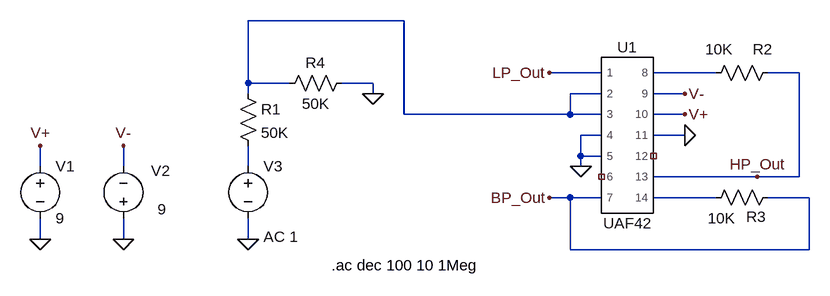
[diagram p0: schematic UAF_Example.asc]
UAF_Example.asc, the LTspice schematic file:
Version 4
SHEET 1 880 680
WIRE -144 16 -384 16
WIRE 160 96 80 96
WIRE 336 96 240 96
WIRE 464 96 416 96
WIRE -384 112 -384 16
WIRE -320 112 -384 112
WIRE -192 112 -240 112
WIRE -384 128 -384 112
WIRE -192 128 -192 112
WIRE 160 128 112 128
WIRE 288 128 240 128
WIRE -144 160 -144 16
WIRE 112 160 112 128
WIRE 112 160 -144 160
WIRE 160 160 112 160
WIRE 288 160 240 160
WIRE 160 192 128 192
WIRE 288 192 240 192
WIRE 128 224 128 192
WIRE 160 224 128 224
WIRE -704 240 -704 208
WIRE -576 240 -576 208
WIRE -384 240 -384 208
WIRE 128 240 128 224
WIRE 400 256 240 256
WIRE 464 256 464 96
WIRE 464 256 400 256
WIRE 112 288 80 288
WIRE 160 288 112 288
WIRE 336 288 240 288
WIRE 480 288 416 288
WIRE -704 352 -704 320
WIRE -576 352 -576 320
WIRE -384 352 -384 320
WIRE 112 368 112 288
WIRE 480 368 480 288
WIRE 480 368 112 368
FLAG 80 96 LP_Out
FLAG 80 288 BP_Out
FLAG 288 128 V-
FLAG 288 160 V+
FLAG 288 192 0
FLAG 400 256 HP_Out
FLAG -704 352 0
FLAG -576 352 0
FLAG -704 208 V+
FLAG -576 208 V-
FLAG -384 352 0
FLAG -192 128 0
FLAG 128 240 0
SYMBOL AutoGenerated\\UAF42 192 192 R0
SYMATTR InstName U1
SYMBOL voltage -704 224 R0
WINDOW 123 0 0 Left 0
WINDOW 39 0 0 Left 0
SYMATTR InstName V1
SYMATTR Value 9
SYMBOL voltage -576 336 R180
WINDOW 0 -72 89 Left 2
WINDOW 3 -66 30 Left 2
WINDOW 123 0 0 Left 0
WINDOW 39 0 0 Left 0
SYMATTR InstName V2
SYMATTR Value 9
SYMBOL voltage -384 224 R0
WINDOW 123 24 124 Left 2
WINDOW 39 0 0 Left 0
SYMATTR Value2 AC 1
SYMATTR InstName V3
SYMATTR Value ""
SYMBOL res -400 112 R0
SYMATTR InstName R1
SYMATTR Value 50K
SYMBOL res 432 80 R90
WINDOW 0 -5 24 VBottom 2
WINDOW 3 -36 91 VTop 2
SYMATTR InstName R2
SYMATTR Value 10K
SYMBOL res 432 272 R90
WINDOW 0 61 34 VBottom 2
WINDOW 3 32 87 VTop 2
SYMATTR InstName R3
SYMATTR Value 10K
SYMBOL res -224 96 R90
WINDOW 0 0 56 VBottom 2
WINDOW 3 32 56 VTop 2
SYMATTR InstName R4
SYMATTR Value 50K
TEXT -256 392 Left 2 !.ac dec 100 10 1Meg

The netlist it stands for:
* UAF_Example.asc
XU1 LP_Out N001 N001 0 0 NC_01 BP_Out N002 V- V+ 0 NC_02 HP_Out N004 UAF42  ; pins 1 2 3 4 5 6 7 8 9 10 11 12 13 14
V1 V+ 0 9
V2 0 V- 9
V3 N003 0 AC 1
R1 N001 N003 50K
R2 HP_Out N002 10K
R3 BP_Out N004 10K
R4 0 N001 50K
.ac dec 100 10 1Meg
.lib C:\Users\Euge\Documents\UTN\Ayudantías\tc2\LTSpice\TPL1\UAF42 PSpice\UAF42.LIB
.backanno
.end